# EAGLE schematic schematic 1 (EAGLE 9.6.2)
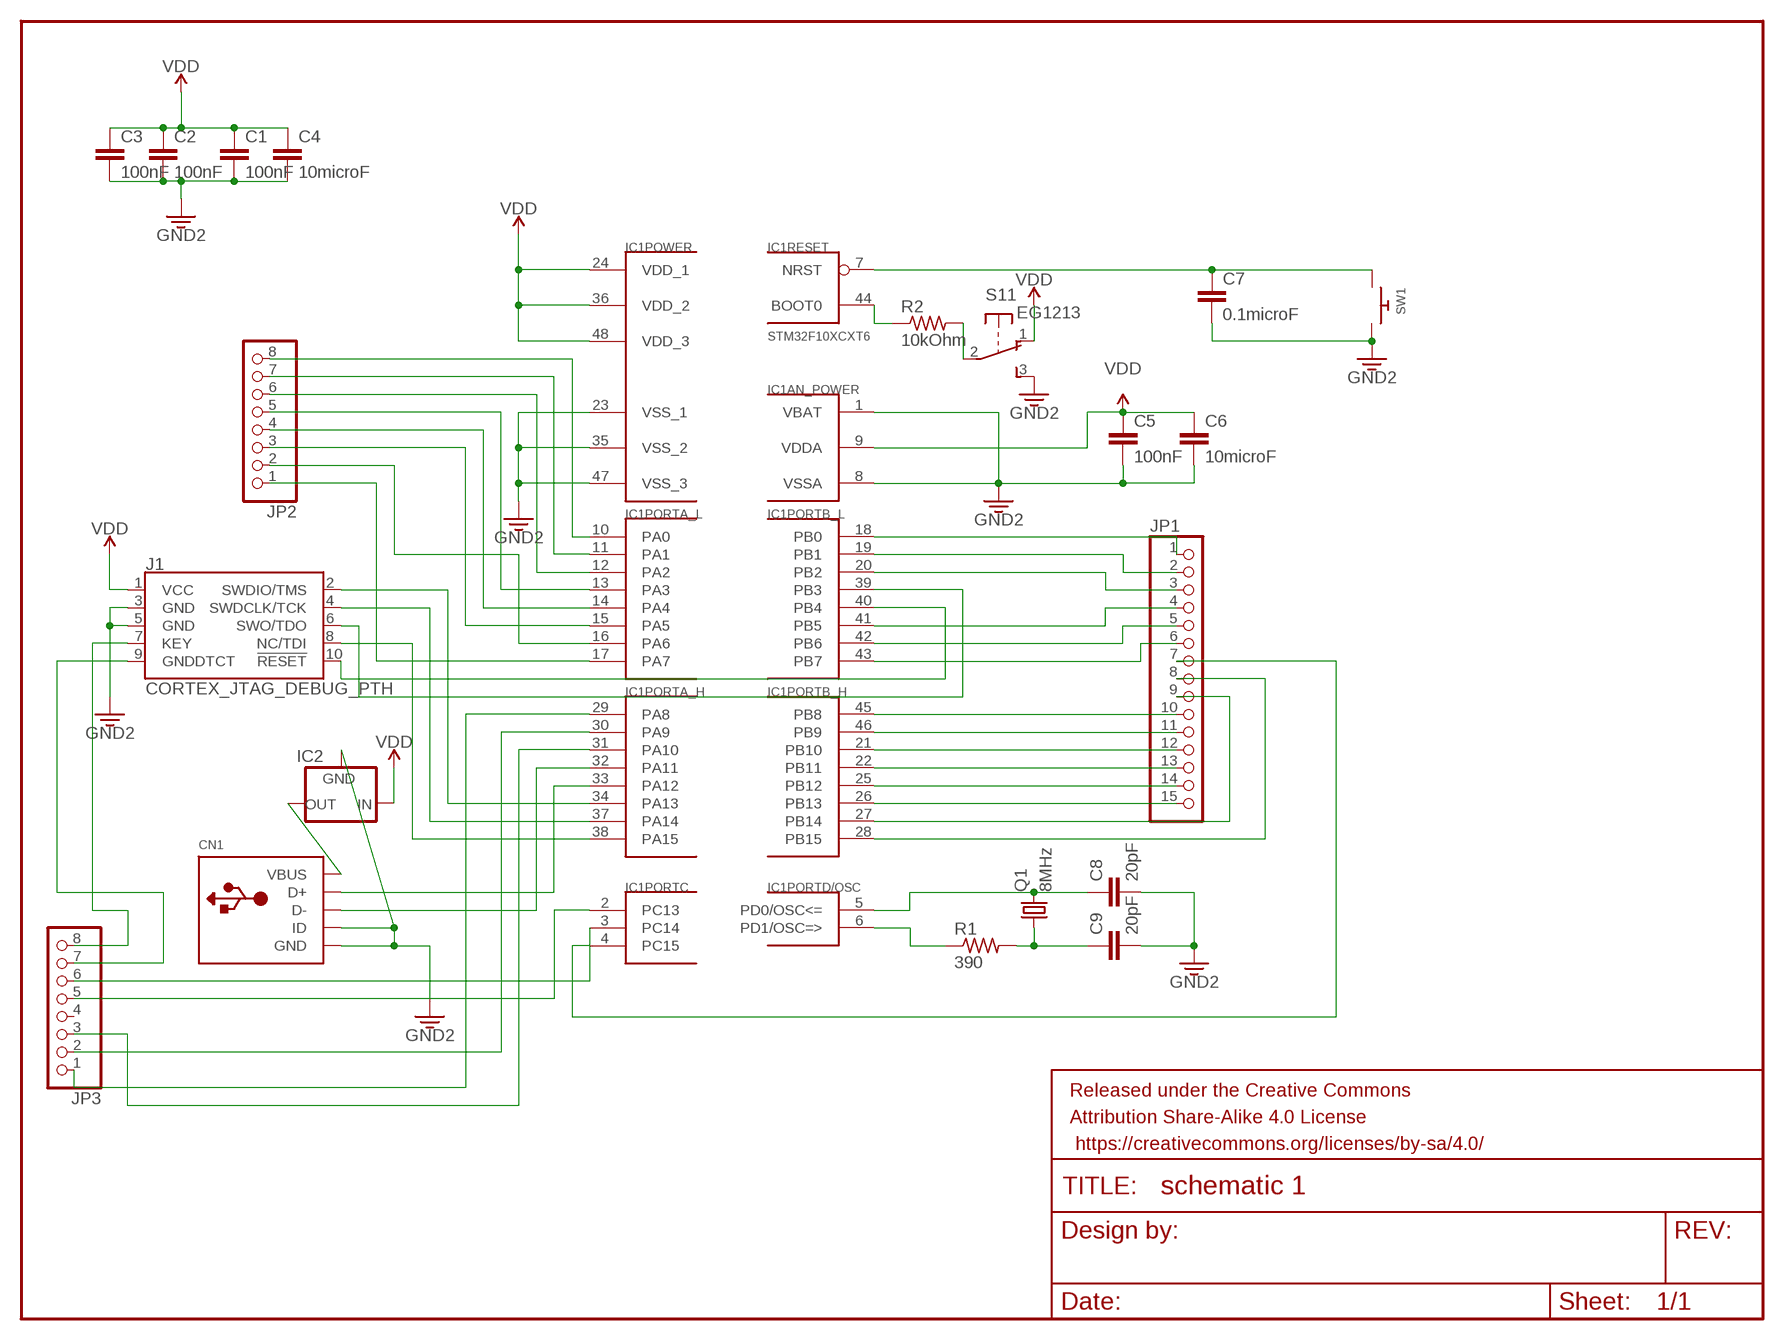
[diagram p0: schematic, sheet 1]

## Parts
C1  100nF  C2,5-3  [C2.5-3]
C2  100nF  C2,5-3  [C2.5-3]
C3  100nF  C2,5-3  [C2.5-3]
C4  10microF  C2,5-3  [C2.5-3]
C5  100nF  C2,5-3  [C2.5-3]
C6  10microF  C2,5-3  [C2.5-3]
C7  0.1microF  C2,5-3  [C2.5-3]
C8  20pF  C2,5-3  [C2.5-3]
C9  20pF  C2,5-3  [C2.5-3]
CN1  USBMINIB  [USB-MINIB]
FRAME1  FRAME-LETTER  [CREATIVE_COMMONS]
IC1  STM32F10XCXT6  [TQFP48]
IC2  MCP1700INLINE  [TO92-INLINE]
J1  CORTEX_JTAG_DEBUG_PTH  [2X5-PTH-1.27MM]
JP1  PINHD-1X15-CB  [1X15-CB]
JP2  PINHD-1X8-3.5MM  [1X08-3.5MM]
JP3  PINHD-1X8-3.5MM  [1X08-3.5MM]
Q1  8MHz  CRYSTAL68SMX  [86SMX]
R1  390  FLIPFLOP-RES  [0805-THM]
R2  10kOhm  FLIPFLOP-RES  [0805-THM]
S1  EG1213  [EG1213]
SW1  SWITCH_PUSHBUTTONEVQ-PE  [TACT_PANA-EVQ]

## Nets
3.3V: C1.2 C2.2 C3.2 C4.2 C5.2 C6.2 C7.2 C8.2 C9.2 CN1.GND CN1.ID IC1.1(AN_POWER:VBAT) IC1.8(AN_POWER:VSSA) IC1.23(POWER:VSS_1) IC1.35(POWER:VSS_2) IC1.47(POWER:VSS_3) IC2.1(GND) J1.3(GND) J1.5(GND) S1.3(1:S) SW1.P$2 ; supply symbol labelled GND2
N$1: C7.1 IC1.7(RESET:NRST) SW1.P$1
N$2: C8.1 IC1.5(PORTD/OSC:PD0/OSC<=) Q1.4
N$3: IC1.44(RESET:BOOT0) R2.1
N$4: C9.1 Q1.1 R1.2
N$5: IC1.6(PORTD/OSC:PD1/OSC=>) R1.1
N$6: R2.2 S1.2(1:P)
N$7: IC1.40(PORTB_L:PB4) J1.10(!RESET)
N$8: IC1.38(PORTA_H:PA15) J1.8(NC/TDI)
N$9: IC1.10(PORTA_L:PA0) JP2.8
N$10: IC1.37(PORTA_H:PA14) J1.4(SWDCLK/TCK)
N$11: IC1.39(PORTB_L:PB3) J1.6(SWO/TDO)
N$12: CN1.D+ IC1.33(PORTA_H:PA12)
N$13: CN1.D- IC1.32(PORTA_H:PA11)
N$14: CN1.VBUS IC2.3(OUT)
N$15: IC1.18(PORTB_L:PB0) JP1.1
N$16: IC1.19(PORTB_L:PB1) JP1.2
N$17: IC1.20(PORTB_L:PB2) JP1.3
N$18: IC1.41(PORTB_L:PB5) JP1.4
N$19: IC1.42(PORTB_L:PB6) JP1.5
N$20: IC1.43(PORTB_L:PB7) JP1.6
N$21: IC1.45(PORTB_H:PB8) JP1.10
N$22: IC1.46(PORTB_H:PB9) JP1.11
N$23: IC1.21(PORTB_H:PB10) JP1.12
N$24: IC1.22(PORTB_H:PB11) JP1.13
N$25: IC1.25(PORTB_H:PB12) JP1.14
N$26: IC1.26(PORTB_H:PB13) JP1.15
N$27: IC1.27(PORTB_H:PB14) JP1.9
N$28: IC1.28(PORTB_H:PB15) JP1.8
N$29: IC1.4(PORTC:PC15) JP1.7
N$30: IC1.34(PORTA_H:PA13) J1.2(SWDIO/TMS)
N$31: IC1.11(PORTA_L:PA1) JP2.7
N$32: IC1.12(PORTA_L:PA2) JP2.6
N$33: IC1.13(PORTA_L:PA3) JP2.5
N$34: IC1.14(PORTA_L:PA4) JP2.4
N$35: IC1.15(PORTA_L:PA5) JP2.3
N$36: IC1.16(PORTA_L:PA6) JP2.2
N$37: IC1.17(PORTA_L:PA7) JP2.1
N$38: J1.7(KEY) JP3.8
N$39: J1.9(GNDDTCT) JP3.7
N$40: IC1.29(PORTA_H:PA8) JP3.1
N$41: IC1.30(PORTA_H:PA9) JP3.2
N$42: IC1.31(PORTA_H:PA10) JP3.3
N$43: IC1.3(PORTC:PC14) JP3.6
N$44: IC1.2(PORTC:PC13) JP3.5
VDD: C1.1 C2.1 C3.1 C4.1 C5.1 C6.1 IC1.9(AN_POWER:VDDA) IC1.24(POWER:VDD_1) IC1.36(POWER:VDD_2) IC1.48(POWER:VDD_3) IC2.2(IN) J1.1(VCC) S1.1(1:O)
Unconnected: JP3.4 S1.MT1(MT) S1.MT2(MT)

## Library data of the parts
C1-C9 = capacitor-wima:C: CAPACITOR naming: grid - package width
CN1 = adafruit:USB: USB Connectors USBMINIB - Surface Mount Female Mini-B USB Connector 4UConnector: 06564 By microbuilder.eu Thru-hole RA Female Mini-B USB Connector 4UConnector: 18732 By ladyada.net
FRAME1 = SparkFun-Aesthetics:FRAME-LETTER: Schematic Frame - Letter Standard 8.5x11 US Letter frame
IC1 = stm32:STM32F10XCXT6: ST STM32F101/103 48pin LQFP
IC2 = adafruit:MCP1700: VOLTAGE REGULATOR
J1 = SparkFun-Connectors:CORTEX_JTAG_DEBUG: Cortex Debug Connector - 10 pin Supports JTAG debug, Serial Wire debug, and Serial Wire Viewer. PTH and SMD connector options available. General Connector Information <http://infocenter.arm.com/help/topic/com.arm.doc.faqs/attached/13634/cortex_debug_connectors.pdf> Products: PTH Connector <http://www.digikey.com/product-detail/en/cnc-tech/3220-10-0100-00/1175-1627-ND/3883661> -via Digi-Key SparkFun PSoc <https://www.sparkfun.com/products/13229> SparkFun T <https://www.sparkfun.com/products/13810>
JP1 = adafruit:PINHD-1X15: PIN HEADER
JP2 JP3 = adafruit:PINHD-1X8: PIN HEADER
Q1 = adafruit:CRYSTAL: CRYSTAL; OC_FARNELL: 6344860; OC_NEWARK: unknown
R1 R2 = adafruit:FLIPFLOP-RES: Flip Flop resistor An 0805 resistor inside a standard 1/4W 5% resistor. Makes for easy mods
S1 = adafruit:EG1213: E-Switch right-angle slide SPDT Part #EG1213 http://www.ladyada.net/library/eagle
SW1 = adafruit:SWITCH_PUSHBUTTON: Buttons SOFTTOUCHSMD_SJ - Soft touch temporary push button (Super Junk Akihabara) Compatible with SKPMANE010 [Mouser: 688-SKPMAN] C&K_KSS = Digikey: KSS221GLFS